# EAGLE schematic eagle (EAGLE 9.3.1)
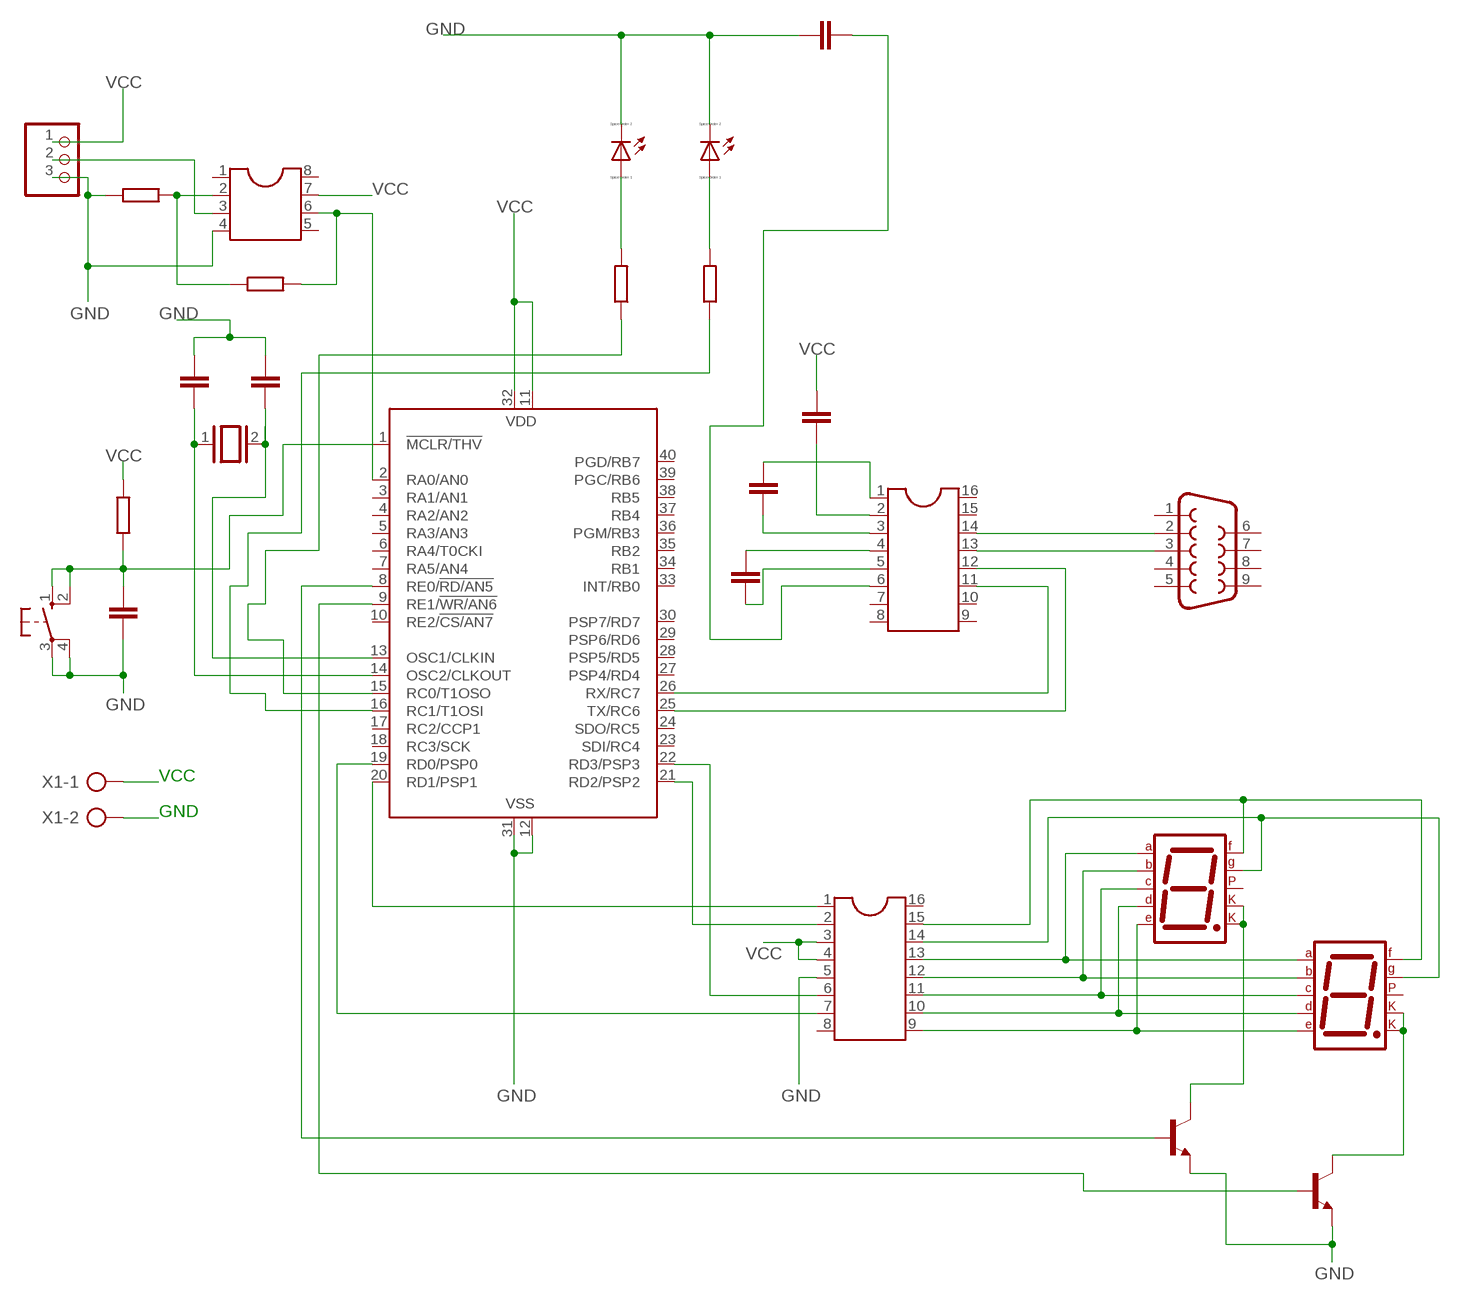
[diagram p0: schematic, sheet 1]

## Parts
4511  DIL16  [DIL16]
AMPLIOP  DIL8  [DIL08]
C1  15pF  C-EU025-050X050  [C025-050X050]
C2  15pF  C-EU025-050X050  [C025-050X050]
C3  1uF  C-EU025-050X050  [C025-050X050]
C4  10uF  C-EU025-050X050  [C025-050X050]
C5  10uF  C-EU025-050X050  [C025-050X050]
C7  100u  C-EU025-050X050  [C025-050X050]
C61  10uF  C-EU025-050X050  [C025-050X050]
D1  7SEG-CK  [7SEG-13]
D2  7SEG-CK  [7SEG-13]
LED1  LED_ELD260  [LED_LD260]
LED2  LED_ELD260  [LED_LD260]
LM35  PINHD-1X3  [1X03]
MAX232  DIL16  [DIL16]
P1/COMPIM  F09V  [F09V]
Q1  2N2222  [TO18]
Q2  2N2222  [TO18]
R1  10k  R-EU_0204/7  [0204/7]
R2  100  R-EU_0204/7  [0204/7]
R3  1k  R-EU_0204/7  [0204/7]
R4  280  R-EU_0204/7  [0204/7]
R5  280  R-EU_0204/7  [0204/7]
S1  10-XX  [B3F-10XX]
U1  PIC16F877P  [DIL40]
X1  AK300/2  [AK300/2]
X11  XTAL/S  [QS]

## Nets
COMPIM: 4511.12 D1.6(B) D2.6(B)
GND: 4511.5 AMPLIOP.4 C1.1 C2.1 C3.1 C61.2 LED1.K(C) LED2.K(C) LM35.3 Q1.1(E) Q2.1(E) R2.1 S1.3(P) S1.4(P1) U1.12(VSS) U1.31(VSS) X1.2
N$2: C2.2 U1.14(OSC2/CLKOUT) X11.1
N$5: MAX232.14 P1/COMPIM.2
N$6: LED2.A R5.2
N$8: C1.2 U1.13(OSC1/CLKIN) X11.2
N$9: 4511.1 U1.20(RD1/PSP1)
N$10: LED1.A R4.2
N$11: MAX232.13 P1/COMPIM.3
N$12: C61.1 MAX232.6
N$13: R4.1 U1.15(RC0/T1OSO)
N$14: R5.1 U1.16(RC1/T1OSI)
N$15: C7.1 MAX232.2
N$18: C4.1 MAX232.3
N$21: C4.2 MAX232.1
N$22: C5.2 MAX232.4
N$24: C5.1 MAX232.5
N$25: C3.2 R1.1 S1.1(S) S1.2(S1) U1.1(!MCLR/THV)
N$26: 4511.7 U1.19(RD0/PSP0)
N$27: D1.3(CK1) D1.8(CK2) Q1.3(C)
N$28: 4511.2 U1.21(RD2/PSP2)
N$29: 4511.6 U1.22(RD3/PSP3)
N$30: AMPLIOP.3 LM35.2
N$31: MAX232.12 U1.25(TX/RC6)
N$32: MAX232.11 U1.26(RX/RC7)
N$33: Q1.2(B) U1.8(RE0/!RD/AN5)
N$34: AMPLIOP.2 R2.2 R3.1
N$35: AMPLIOP.6 R3.2 U1.2(RA0/AN0)
N$36: 4511.13 D1.7(A) D2.7(A)
N$37: 4511.10 D1.2(D) D2.2(D)
N$38: 4511.11 D1.4(C) D2.4(C)
N$39: 4511.9 D1.1(E) D2.1(E)
N$44: 4511.14 D1.10(G) D2.10(G)
N$47: D2.3(CK1) D2.8(CK2) Q2.3(C)
N$48: Q2.2(B) U1.9(RE1/!WR/AN6)
N$53: 4511.15 D1.9(F) D2.9(F)
VCC: 4511.3 4511.4 AMPLIOP.7 C7.2 LM35.1 R1.2 U1.11(VDD) U1.32(VDD) X1.1
Unconnected: 4511.8 4511.16 AMPLIOP.1 AMPLIOP.5 AMPLIOP.8 D1.5(DP) D2.5(DP) MAX232.7 MAX232.8 MAX232.9 MAX232.10 MAX232.15 MAX232.16 P1/COMPIM.1 P1/COMPIM.4 P1/COMPIM.5 P1/COMPIM.6 P1/COMPIM.7 P1/COMPIM.8 P1/COMPIM.9 U1.3(RA1/AN1) U1.4(RA2/AN2) U1.5(RA3/AN3) U1.6(RA4/T0CKI) U1.7(RA5/AN4) U1.10(RE2/!CS/AN7) U1.17(RC2/CCP1) U1.18(RC3/SCK) U1.23(SDI/RC4) U1.24(SDO/RC5) U1.27(PSP4/RD4) U1.28(PSP5/RD5) U1.29(PSP6/RD6) U1.30(PSP7/RD7) U1.33(INT/RB0) U1.34(RB1) U1.35(RB2) U1.36(PGM/RB3) U1.37(RB4) U1.38(RB5) U1.39(PGC/RB6) U1.40(PGD/RB7)

## Library data of the parts
4511 MAX232 = ic-package:DIL16: Dual In Line / Socket
AMPLIOP = ic-package:DIL8: Dual In Line / Socket
C1-C5 C7 C61 = rcl:C-EU: CAPACITOR, European symbol
D1 D2 = special:7SEG-CK: 7-segment DISPLAY single cathode, 13 mm
LED1 LED2 = eagle-ltspice:LED_E: LED Source: http://www.osram.convergy.de Source: www.luxeon.com Source: www.kingbright.com; SPICEMODEL: NONE; SPICEPREFIX: D; SPICETYPE: diode
LM35 = pinhead:PINHD-1X3: PIN HEADER
P1/COMPIM = con-subd:F09: SUB-D; OC_FARNELL: unknown; OC_NEWARK: unknown
Q1 Q2 = transistor:2N2222: NPN TRANSISTOR
R1-R5 = rcl:R-EU_: RESISTOR, European symbol
S1 = switch-omron:10-XX: OMRON SWITCH; MPN: B3F-1000; OC_FARNELL: 176432; OC_NEWARK: 36M3542
U1 = microchip:PIC16F87*: MICROCONTROLLER; MF: MICROCHIP; MPN: PIC16F877-04/P; OC_FARNELL: 9761349; OC_NEWARK: 61K3463
X1 = con-ptr500:AK300/2: CONNECTOR; OC_FARNELL: unknown; OC_NEWARK: unknown
X11 = special:XTAL/S: CRYSTAL